# EasyEDA schematic 1-Schematic_CessnaCitationX_Front.json
TITLE: Sheet_2; REV: 1.0; Date: 2019-04-05; Sheet: 1/1; Drawn By: arnaud.dessein; Company: Your Company
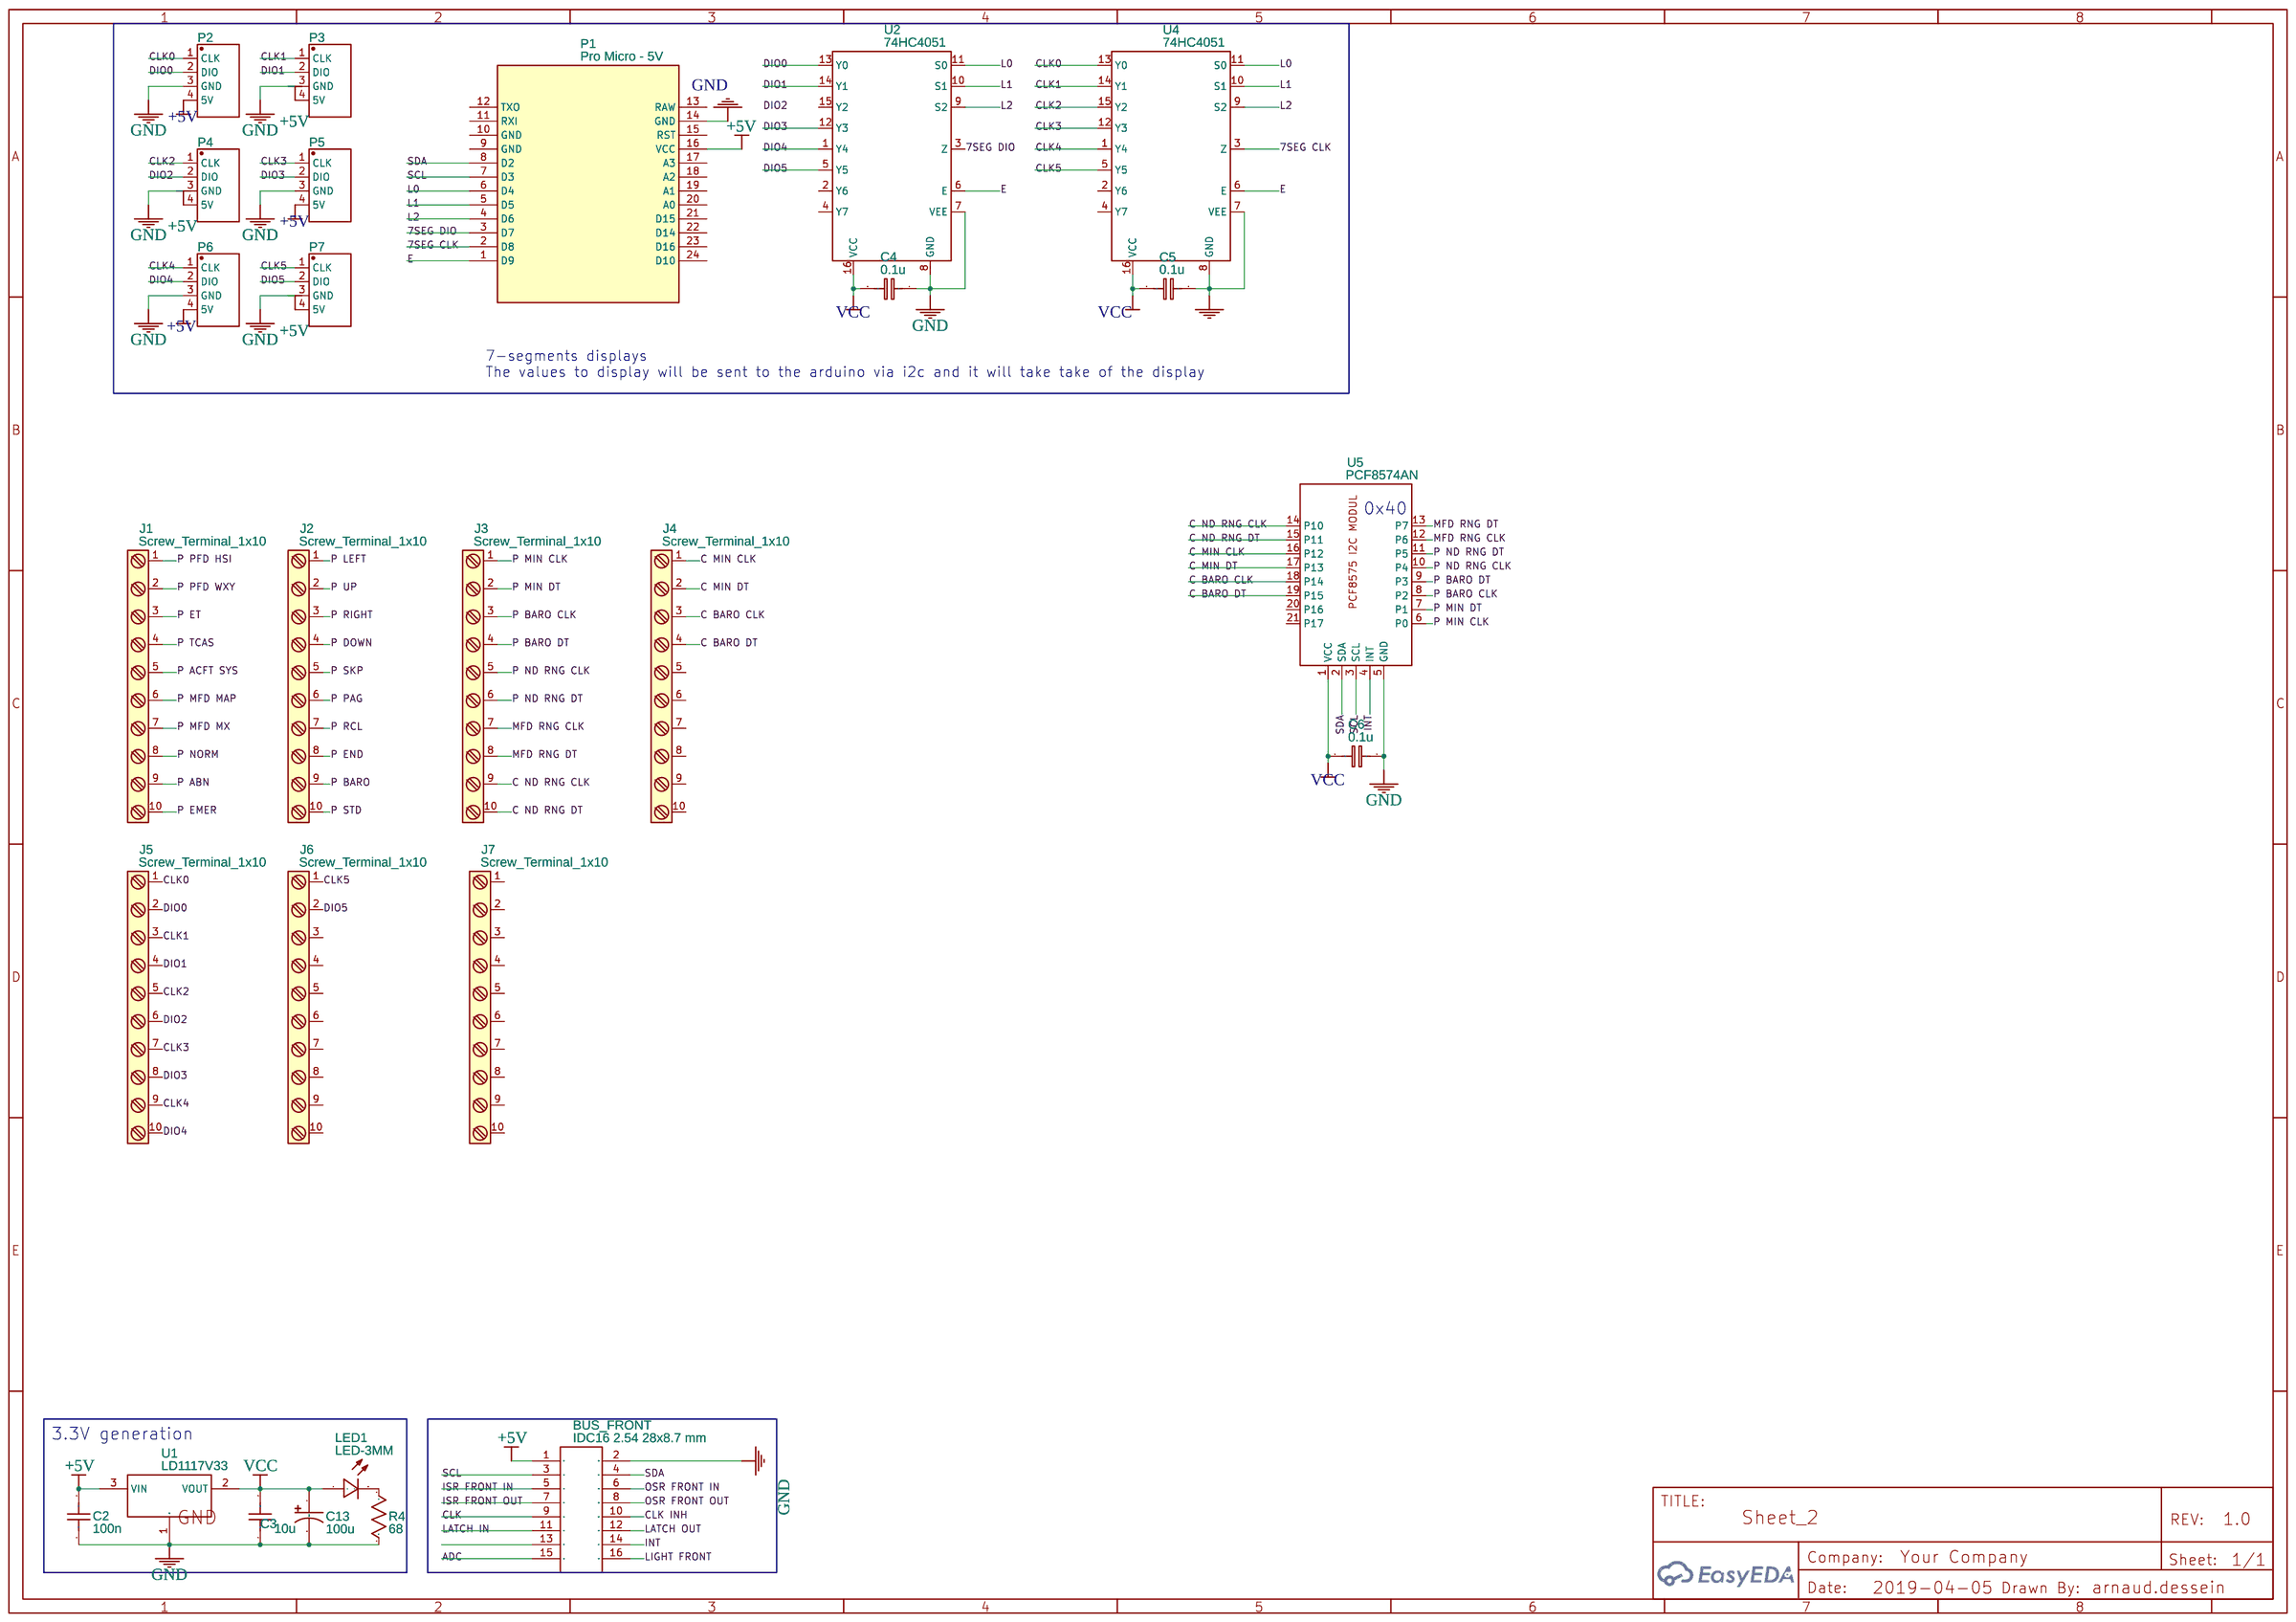
[diagram p0: schematic sheet]

## Parts
BUS_FRONT  IDC16 2.54 28x8.7 mm  [IDC16 2.54 28X8.7 MM]
C2  100n  [RAD-0.1]
C3  10u  [RAD-0.1]
C4  0.1u  [RAD-0.1]
C5  0.1u  [RAD-0.1]
C6  0.1u  [RAD-0.1]
C13  100u  [CAP-D3.0XF1.5]
J1  Screw_Terminal_1x10  [SIP-10]
J2  Screw_Terminal_1x10  [SIP-10]
J3  Screw_Terminal_1x10  [SIP-10]
J4  Screw_Terminal_1x10  [SIP-10]
J5  Screw_Terminal_1x10  [SIP-10]
J6  Screw_Terminal_1x10  [SIP-10]
J7  Screw_Terminal_1x10  [SIP-10]
LED1  LED-3MM  [LED-3MM/2.54]
P1  Pro Micro - 5V  [PRO MICRO - 5V]
P2  7seg display module TM1637  [DUPONT-2.54-4P]
P3  7seg display module TM1637  [DUPONT-2.54-4P]
P4  7seg display module TM1637  [DUPONT-2.54-4P]
P5  7seg display module TM1637  [DUPONT-2.54-4P]
P6  7seg display module TM1637  [DUPONT-2.54-4P]
P7  7seg display module TM1637  [DUPONT-2.54-4P]
R4  68  [AXIAL-0.3]
U1  LD1117V33  [TO-220(TO-220-3)]
U2  74HC4051  [DIL16-O]
U4  74HC4051  [DIL16-O]
U5  PCF8574AN  [PCF8575 I2C MODUL]

## Library data of the parts
BUS_FRONT = -: Manufacturer Part: ?; Contributor: julien.pitault.1984
C2 C3 = Cap_RAD-0.1_US: Manufacturer Part: ?
C4-C6 = Cap_RAD-0.1_EU: Manufacturer Part: ?
C13 = Cap_Electrolytic(TH)_D3.0XF1.5_US: Manufacturer Part: ?
J1-J7 = -: Contributor: KiCAD; license: https://www.gnu.org/licenses/lgpl-2.1.html; Manufacturer Part: ?
LED1 = -: Supplier: LCSC; Manufacturer: EVERLIGHT; Manufacturer Part: 204-10SURD/S530-A3; Supplier Part: C99772
P1 = -: sourceId: 1T5FDZYC8; Manufacturer Part: ?
P2-P7 = -: Supplier: LCSC; Manufacturer: ReliaPro; Manufacturer Part: WJ2EDGVC-5.08-4P; image: //image.lceda.cn/szlcsc/C8471.jpg; Supplier Part: C8471
R4 = Res_AXIAL-0.3(1/8W)_US: Manufacturer Part: ?
U1 = -: Supplier: LCSC; Supplier Part: C283467; Manufacturer: STMicroelectronics; Contributor: LCSC
U2 U4 = -: Contributor: Ftec; Manufacturer Part: ?
U5 = -: Manufacturer Part: ?

## Nets
+5V: BUS_FRONT.1(P1) C2.2 P1.16(VCC) P2.4(5V) P3.4(5V) P4.4(5V) P5.4(5V) P6.4(5V) P7.4(5V) U1.3(VIN)
GND: BUS_FRONT.2(P2) C2.1 C3.1 C4.1 C5.1 C6.1 C13.2 P1.14(GND) P2.3(GND) P3.3(GND) P4.3(GND) P5.3(GND) P6.3(GND) P7.3(GND) R4.2 U1.1(GND) U2.7(VEE) U2.8(GND) U4.7(VEE) U4.8(GND) U5.5(GND)
VCC: C3.2 C4.2 C5.2 C6.2 C13.1 LED1.1(+) U1.2(VOUT) U2.16(VCC) U4.16(VCC) U5.1(VCC)
7SEG CLK: P1.2(D8) U4.3(Z)
7SEG DIO: P1.3(D7) U2.3(Z)
ADC: BUS_FRONT.15
C BARO CLK: J4.3 U5.18(P14)
C BARO DT: J4.4 U5.19(P15)
C MIN CLK: J4.1 U5.16(P12)
C MIN DT: J4.2 U5.17(P13)
C ND RNG CLK: J3.9 U5.14(P10)
C ND RNG DT: J3.10 U5.15(P11)
CLK: BUS_FRONT.9(P9)
CLK0: J5.1 P2.1(CLK) U4.13(Y0)
CLK1: J5.3 P3.1(CLK) U4.14(Y1)
CLK2: J5.5 P4.1(CLK) U4.15(Y2)
CLK3: J5.7 P5.1(CLK) U4.12(Y3)
CLK4: J5.9 P6.1(CLK) U4.1(Y4)
CLK5: J6.1 P7.1(CLK) U4.5(Y5)
CLK INH: BUS_FRONT.10(P10)
DIO0: J5.2 P2.2(DIO) U2.13(Y0)
DIO1: J5.4 P3.2(DIO) U2.14(Y1)
DIO2: J5.6 P4.2(DIO)
DIO3: J5.8 P5.2(DIO) U2.12(Y3)
DIO4: J5.10 P6.2(DIO) U2.1(Y4)
DIO5: J6.2 P7.2(DIO) U2.5(Y5)
E: P1.1(D9) U2.6(E) U4.6(E)
INT: BUS_FRONT.14 U5.4(INT)
ISR FRONT IN: BUS_FRONT.5(P5)
ISR FRONT OUT: BUS_FRONT.7(P7)
L0: P1.6(D4) U2.11(S0) U4.11(S0)
L1: P1.5(D5) U2.10(S1) U4.10(S1)
L2: P1.4(D6) U2.9(S2) U4.9(S2)
LATCH IN: BUS_FRONT.11
LATCH OUT: BUS_FRONT.12
LIGHT FRONT: BUS_FRONT.16
MFD RNG CLK: J3.7 U5.12(P6)
MFD RNG DT: J3.8 U5.13(P7)
OSR FRONT IN: BUS_FRONT.6(P6)
OSR FRONT OUT: BUS_FRONT.8(P8)
P ABN: J1.9
P ACFT SYS: J1.5
P BARO: J2.9
P BARO CLK: J3.3 U5.8(P2)
P BARO DT: J3.4 U5.9(P3)
P DOWN: J2.4
P EMER: J1.10
P END: J2.8
P ET: J1.3
P LEFT: J2.1
P MFD MAP: J1.6
P MFD MX: J1.7
P MIN CLK: J3.1 U5.6(P0)
P MIN DT: J3.2 U5.7(P1)
P ND RNG CLK: J3.5 U5.10(P4)
P ND RNG DT: J3.6 U5.11(P5)
P NORM: J1.8
P PAG: J2.6
P PFD HSI: J1.1
P PFD WXY: J1.2
P RCL: J2.7
P RIGHT: J2.3
P SKP: J2.5
P STD: J2.10
P TCAS: J1.4
P UP: J2.2
SCL: BUS_FRONT.3(P3) P1.7(D3) U5.3(SCL)
SDA: BUS_FRONT.4(P4) P1.8(D2) U5.2(SDA)
Net-(LED1-2): LED1.2(-) R4.1

Not connected (* = marked no-connect by the designer): BUS_FRONT 13; J4 5 6 7 8 9 10; J6 3 4 5 6 7 8 9 10; J7 1 2 3 4 5 6 7 8 9 10; P1 9(GND) 10(GND) 11(RXI) 12(TXO) 13(RAW) 15(RST) 17(A3) 18(A2) 19(A1) 20(A0) 21(D15) 22(D14) 23(D16) 24(D10); U2 2(Y6) 4(Y7) 15(Y2); U4 2(Y6) 4(Y7); U5 20(P16) 21(P17)

## Notes on the sheet
- 7-segments displays
  The values to display will be sent to the arduino via i2c and it will take take of the display
- 0x40
- 3.3V generation
